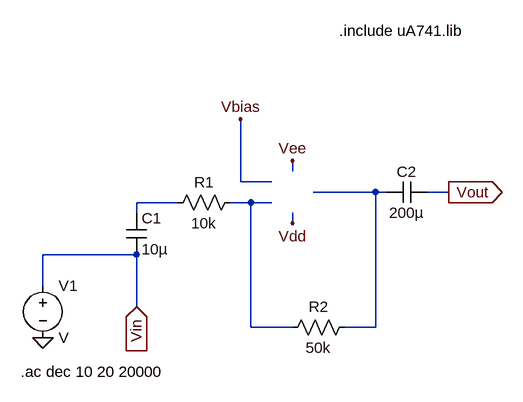
[diagram p0: schematic Amplifier.asc]
Amplifier.asc, the LTspice schematic file:
Version 4
SHEET 1 880 680
WIRE -416 144 -416 128
WIRE -496 160 -496 64
WIRE -448 160 -496 160
WIRE -288 176 -384 176
WIRE -272 176 -288 176
WIRE -176 176 -208 176
WIRE -592 192 -656 192
WIRE -480 192 -512 192
WIRE -448 192 -480 192
WIRE -656 208 -656 192
WIRE -416 224 -416 208
WIRE -656 272 -800 272
WIRE -800 320 -800 272
WIRE -656 352 -656 272
WIRE -480 384 -480 192
WIRE -416 384 -480 384
WIRE -288 384 -288 176
WIRE -288 384 -336 384
FLAG -656 352 Vin
IOPIN -656 352 In
FLAG -176 176 Vout
IOPIN -176 176 Out
FLAG -496 64 Vbias
FLAG -416 128 Vee
FLAG -416 224 Vdd
FLAG -800 400 0
SYMBOL cap -672 208 R0
SYMATTR InstName C1
SYMATTR Value 10µ
SYMBOL res -496 176 R90
WINDOW 0 0 56 VBottom 2
WINDOW 3 32 56 VTop 2
SYMATTR InstName R1
SYMATTR Value 10k
SYMBOL res -432 400 R270
WINDOW 0 32 56 VTop 2
WINDOW 3 0 56 VBottom 2
SYMATTR InstName R2
SYMATTR Value 50k
SYMBOL cap -208 160 R90
WINDOW 0 0 32 VBottom 2
WINDOW 3 32 32 VTop 2
SYMATTR InstName C2
SYMATTR Value 200µ
SYMBOL voltage -800 304 R0
SYMATTR InstName V1
TEXT -344 -72 Left 2 !.include uA741.lib
TEXT -834 452 Left 2 !.ac dec 10 20 20000

The netlist it stands for:
* Amplifier.asc
C1 N002 Vin 10µ
R1 N003 N002 10k
R2 N003 N001 50k
C2 Vout N001 200µ
V1 Vin 0 V
.include uA741.lib
.ac dec 10 20 20000
.backanno
.end